# Altium schematic sheet Power Regulation.SchDoc: Power Regulation
size A4; DrawnBy: Alex Dyer; Revision: A; SheetNumber: 5; SheetTotal: 5
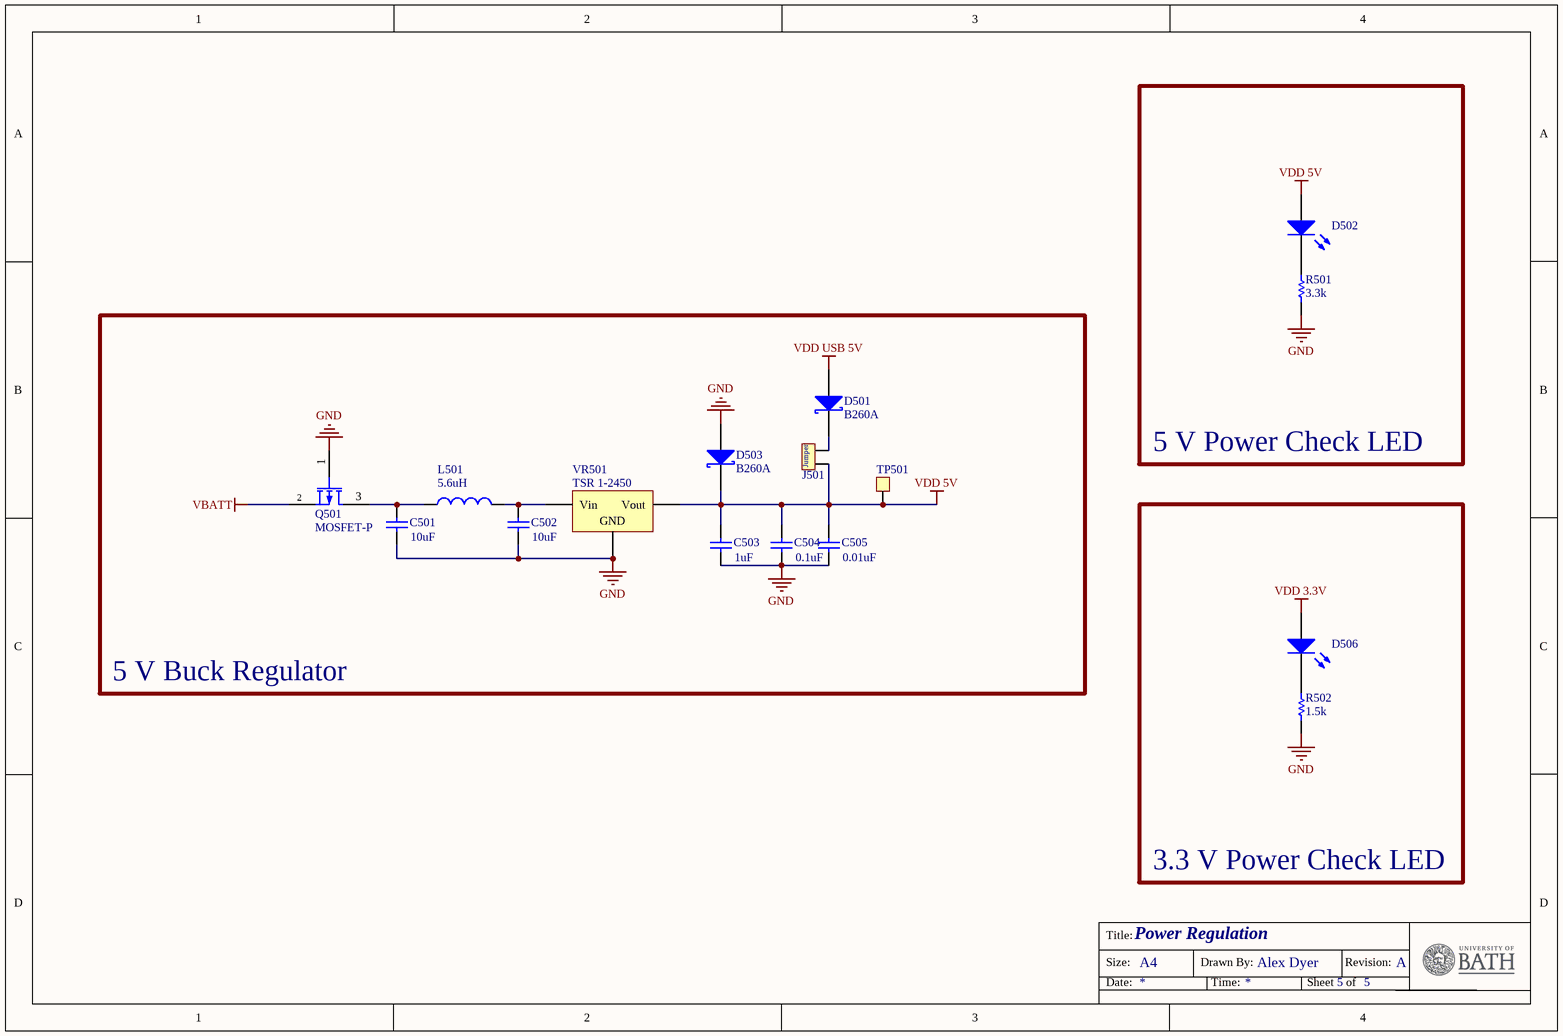
[diagram p0: Power Regulation.SchDoc]

## Parts
C501  value 10uF  [0805 Cap]  (hidden comment: C2012X5R1V106K085AC)
C502  value 10uF  [0805 Cap]  (hidden comment: C2012X5R1V106K085AC)
C503  value 1uF  [0805 Cap]  (hidden comment: C2012X5R1V106K085AC)
C504  value 0.1uF  [0805 Cap]  (hidden comment: C2012X5R1V106K085AC)
C505  value 0.01uF  [0805 Cap]  (hidden comment: C2012X5R1V106K085AC)
D501  B260A  [SMA (DO-214AC)]
D502  LED2  [SML-211 Series]  (value not drawn)
D503  B260A  [SMA (DO-214AC)]
D506  LED2  [SML-211 Series]  (value not drawn)
J501  Jumper  [2.54mm 2 pin Jumper]  (value not drawn)
L501  value 5.6uH  [SRR1280A]  (hidden comment: SRR1280A-331K)
Q501  MOSFET-P  [SOT95P230X110-3N]
R501  value 3.3k  [0603]  (hidden comment: 0603)
R502  value 1.5k  [0603]  (hidden comment: 0603)
TP501  Test Point  [Test Point THT 1mm]  (value not drawn)
VR501  TSR 1-2450  [TRACOPOWER TSR]

## Blocks framed on the sheet
5 V Power Check LED: D502 R501
5 V Buck Regulator: C501-C505 D501 D503 J501 L501 Q501 TP501 VR501
3.3 V Power Check LED: D506 R502

## Nets
GND: C501.1 C502.1 C503.1 C504.1 C505.1 D503.1(A) Q501.1(G) R501.1 R502.1 VR501.2(GND)
VBATT: Q501.2(S)
VDD 3.3V: D506.1(A)
VDD 5V: C503.2 C504.2 C505.2 D502.1(A) D503.2(K) J501.2 TP501.1 VR501.3(Vout)
VDD USB 5V: D501.1(A)
NetC501_2: C501.2 L501.1 Q501.3(D)
NetC502_2: C502.2 L501.2 VR501.1(Vin)
NetD501_2: D501.2(K) J501.1
NetD502_2: D502.2(K) R501.2
NetD506_2: D506.2(K) R502.2

## Notes on the sheet
- Title:
- Size:
- Date:
- A4
- Drawn By:
- Time:
- Sheet
- Revision:
- of

## Library data of the parts
C501-C505 = Cap: https://uk.rs-online.com/web/p/mlccs-multilayer-ceramic-capacitors/9159325/?relevancy-data=636F3D3126696E3D4931384E525353746F636B4E756D626572266C753D656E266D6D3D6D61746368616C6C26706D3D5E2828282872737C5253295B205D3F293F285C647B337D5B5C2D5C735D3F5C647B332C347D5B705061415D3F29297C283235285C647B387D7C5C647B317D5C2D5C647B377D2929292426706F3D3126736E3D592673723D2673743D52535F53544F434B5F4E554D4245522677633D4E4F4E45267573743D3931352D39333235267374613D3931353933323526&searchHistory=%7B%22enabled%22%3Atrue%7D; Catalogue No.: 766-1217; Published: 8-Jun-2000; LatestRevisionDate: 17-Jul-2002; LatestRevisionNote: Re-released for DXP Platform.; PackageReference: RAD-0.3; Publisher: Altium Limited; PackageDescription: Radial Cap, Thru-Hole; 2 Leads; 0.3 in Pin Spacing
D501 D503 = D Schottky: Schottky Diode; ComponentLink1Description: Purchase; ComponentLink1URL: https://www.mouser.co.uk/ProductDetail/Diodes-Incorporated/B260A-13-F?qs=9XwZYT68TnR%252B3fnyovGFLA%3D%3D; Purchase: https://www.mouser.co.uk/ProductDetail/Diodes-Incorporated/B260A-13-F?qs=9XwZYT68TnR%252B3fnyovGFLA%3D%3D
D502 D506 = LED2: Typical RED, GREEN, YELLOW, AMBER GaAs LED; ComponentLink1Description: Purchase; ComponentLink1URL: https://uk.rs-online.com/web/p/leds/7007897/; Purchase: https://uk.rs-online.com/web/p/leds/7007897/
L501 = Inductor: https://www.mouser.co.uk/ProductDetail/Bourns/SRR1240-5R6M?qs=xrpI9KL%2FXvsXaYuKX%252BElwQ%3D%3D; Code_IEC: 1005; Catalogue No.: 652-SRR1280A-331K; Published: 8-Jun-2000; LatestRevisionDate: 29-May-2009; LatestRevisionNote: IPC-7351 Footprint Added.; PackageReference: 0402-A; Publisher: Altium Limited; PackageDescription: Chip Inductor; Code_JEITA: 0402
Q501 = MOSFET-P: P-Channel MOSFET; ComponentLink1Description: Purchase; ComponentLink1URL: https://www.mouser.co.uk/ProductDetail/Nexperia/PMV250EPEAR?qs=Yna0arPQ0CTtAa8k6X9CyQ%3D%3D; Purchase: https://www.mouser.co.uk/ProductDetail/Nexperia/PMV250EPEAR?qs=Yna0arPQ0CTtAa8k6X9CyQ%3D%3D
R501 R502 = Res1: Resistor; Published: 8-Jun-2000; LatestRevisionDate: 17-Jul-2002; LatestRevisionNote: Re-released for DXP Platform.; PackageReference: AXIAL-0.3; Publisher: Altium Limited; PackageDescription: Axial Device, Thru-Hole; 2 Leads; 0.3 in Pin Spacing; ComponentLink1Description: Purcahse; ComponentLink1URL: https://uk.rs-online.com/web/p/mlccs-multilayer-ceramic-capacitors/2644236/; Purchase: https://uk.rs-online.com/web/p/mlccs-multilayer-ceramic-capacitors/2644236/
VR501 = Volt Reg: https://uk.farnell.com/tracopower/tsr-1-2450/converter-dc-dc-5v-1a-sip/dp/1696320; Catalogue No.: 666-4379; Published: 24-Mar-1999; LatestRevisionDate: 29-May-2009; LatestRevisionNote: IPC-7351 Footprint Added.; PackageReference: D2PAK; Publisher: Altium Limited; PackageDescription: 3-Pin Transistor Outline Package 2.54 mm Pitch, 15.1 mm Lead Span
J501 = Jumper: Purchase: https://www.mouser.co.uk/ProductDetail/Molex/22-28-5027?qs=l%252BWx29wYPrz7EnZr1XjkzQ%3D%3D
TP501 = Test Point: ComponentLink1Description: Purchase; ComponentLink1URL: https://uk.rs-online.com/web/p/terminal-posts/2622179/?relevancy-data=7365617263685F636173636164655F6F726465723D31267365617263685F696E746572666163655F6E616D653D4931384E525353746F636B4E756D626572267365617263685F6C616E67756167655F757365643D656E267365617263685F6D617463685F6D6F64653D6D61746368616C6C267365617263685F7061747465726E5F6D6174636865643D5E2828282872737C5253295B205D3F293F285C647B337D5B5C2D5C735D3F5C647B332C347D5B705061415D3F29297C283235285C647B387D7C5C647B317D5C2D5C647B377D29292924267365617263685F7061747465726E5F6F726465723D31267365617263685F73745F6E6F726D616C697365643D59267365617263685F726573706F6E73655F616374696F6E3D267365617263685F747970653D52535F53544F434B5F4E554D424552267365617263685F77696C645F63617264696E675F6D6F64653D4E4F4E45267365617263685F6B6579776F72643D3236322D32313739267365617263685F6B6579776F72645F6170703D32363232313739267365617263685F636F6E6669673D3026&searchHistory=%7B%22enabled%22%3Atrue%7D\; Purchase: https://uk.rs-online.com/web/p/terminal-posts/2622179/?relevancy-data=7365617263685F636173636164655F6F726465723D31267365617263685F696E746572666163655F6E616D653D4931384E525353746F636B4E756D626572267365617263685F6C616E67756167655F757365643D656E267365617263685F6D617463685F6D6F64653D6D61746368616C6C267365617263685F7061747465726E5F6D6174636865643D5E2828282872737C5253295B205D3F293F285C647B337D5B5C2D5C735D3F5C647B332C347D5B705061415D3F29297C283235285C647B387D7C5C647B317D5C2D5C647B377D29292924267365617263685F7061747465726E5F6F726465723D31267365617263685F73745F6E6F726D616C697365643D59267365617263685F726573706F6E73655F616374696F6E3D267365617263685F747970653D52535F53544F434B5F4E554D424552267365617263685F77696C645F63617264696E675F6D6F64653D4E4F4E45267365617263685F6B6579776F72643D3236322D32313739267365617263685F6B6579776F72645F6170703D32363232313739267365617263685F636F6E6669673D3026&searchHistory=%7B%22enabled%22%3Atrue%7D\